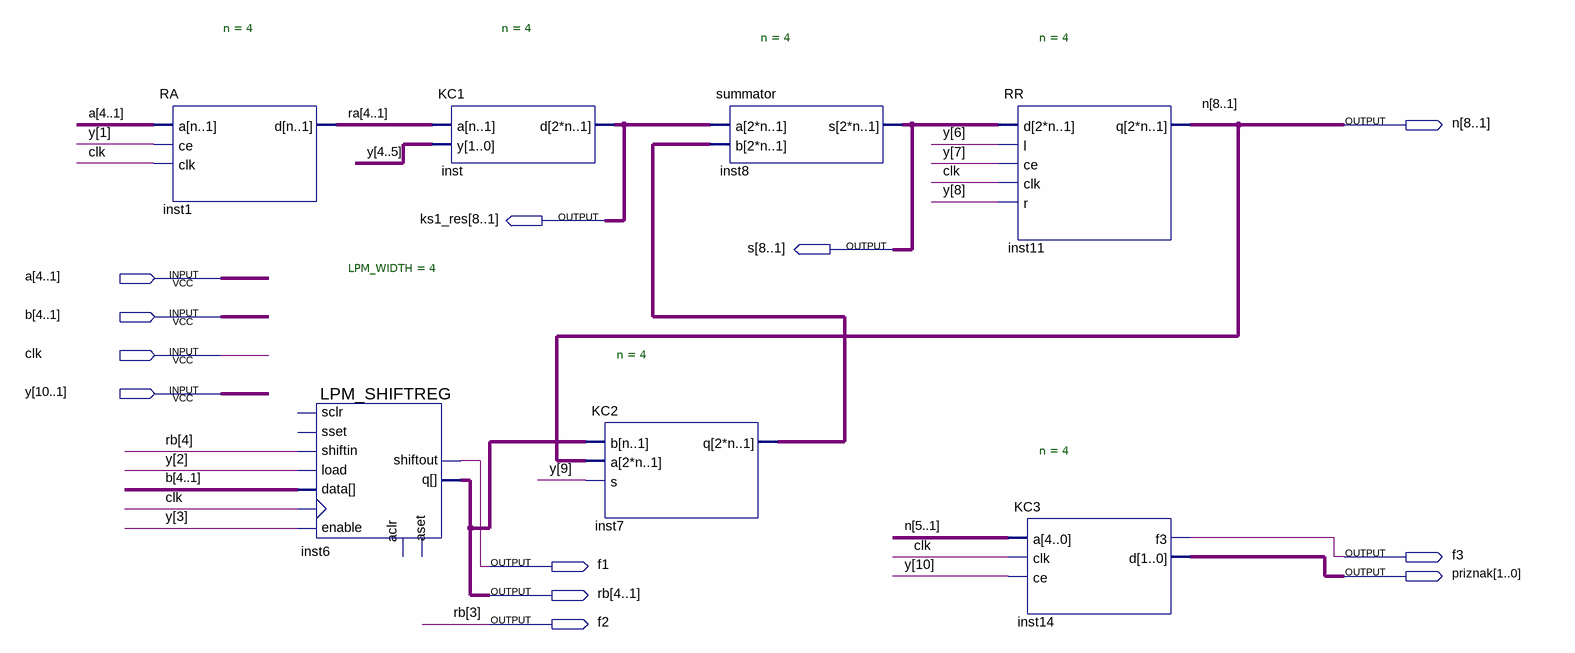
[diagram p0: schematic sheet]
// Quartus schematic block_oper.bdf as structural Verilog: 7 symbols, 12 pins
module block_oper (
  input  [4:1] a,
  input  [4:1] b,
  input  clk,
  input  [10:1] y,
  output [8:1] n,
  output [8:1] ks1_res,
  output [8:1] s,
  output f3,
  output f1,
  output [1:0] priznak,
  output [4:1] rb,
  output f2
);

  wire [4:1] ra;
  wire [7:0] inst7_q;

  RA #(.n(4)) inst1 (.a(a), .ce(y[1]), .clk(clk), .d(ra));
  LPM_SHIFTREG #(.LPM_WIDTH(4)) inst6 (
    .shiftin(rb[4]), .enable(y[3]), .clock(clk), .data(b), .load(y[2]), .shiftout(f1),
    .q({rb[4], f2, rb[2:1]}));  // open: sset, sclr, aset, aclr
  KC1 #(.n(4)) inst (.a(ra), .y({y[4], y[5]}), .d(ks1_res));
  KC2 #(.n(4)) inst7 (.b({rb[4], f2, rb[2:1]}), .a(n), .s(y[9]), .q(inst7_q));
  summator #(.n(4)) inst8 (.a(ks1_res), .b(inst7_q), .s(s));
  RR #(.n(4)) inst11 (.d(s), .l(y[6]), .ce(y[7]), .clk(clk), .r(y[8]), .q(n));
  KC3 #(.n(4)) inst14 (.a(n[5:1]), .clk(clk), .ce(y[10]), .f3(f3), .d(priznak));

  assign rb[3] = f2;
endmodule
